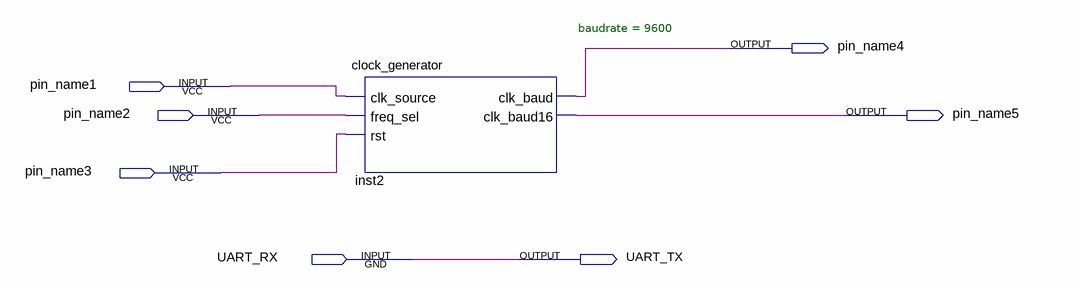
[diagram p0: schematic sheet]
// Quartus schematic rs232.bdf as structural Verilog: 1 symbols, 7 pins
module rs232 (
  input  pin_name1,
  input  pin_name2,
  input  pin_name3,
  input  UART_RX,
  output pin_name4,
  output pin_name5,
  output UART_TX
);

  clock_generator #(.baudrate(9600)) inst2 (
    .clk_source(pin_name1), .freq_sel(pin_name2), .rst(pin_name3), .clk_baud(pin_name4),
    .clk_baud16(pin_name5));

  assign UART_TX = UART_RX;
endmodule
